# Altium schematic sheet main.SchDoc
size A4; SheetNumber: 2; SheetTotal: 6; SPICEModelCacheQOCYWOGJ: <root> / <DocumentId>QOCYWOGJ</DocumentId> / </root>
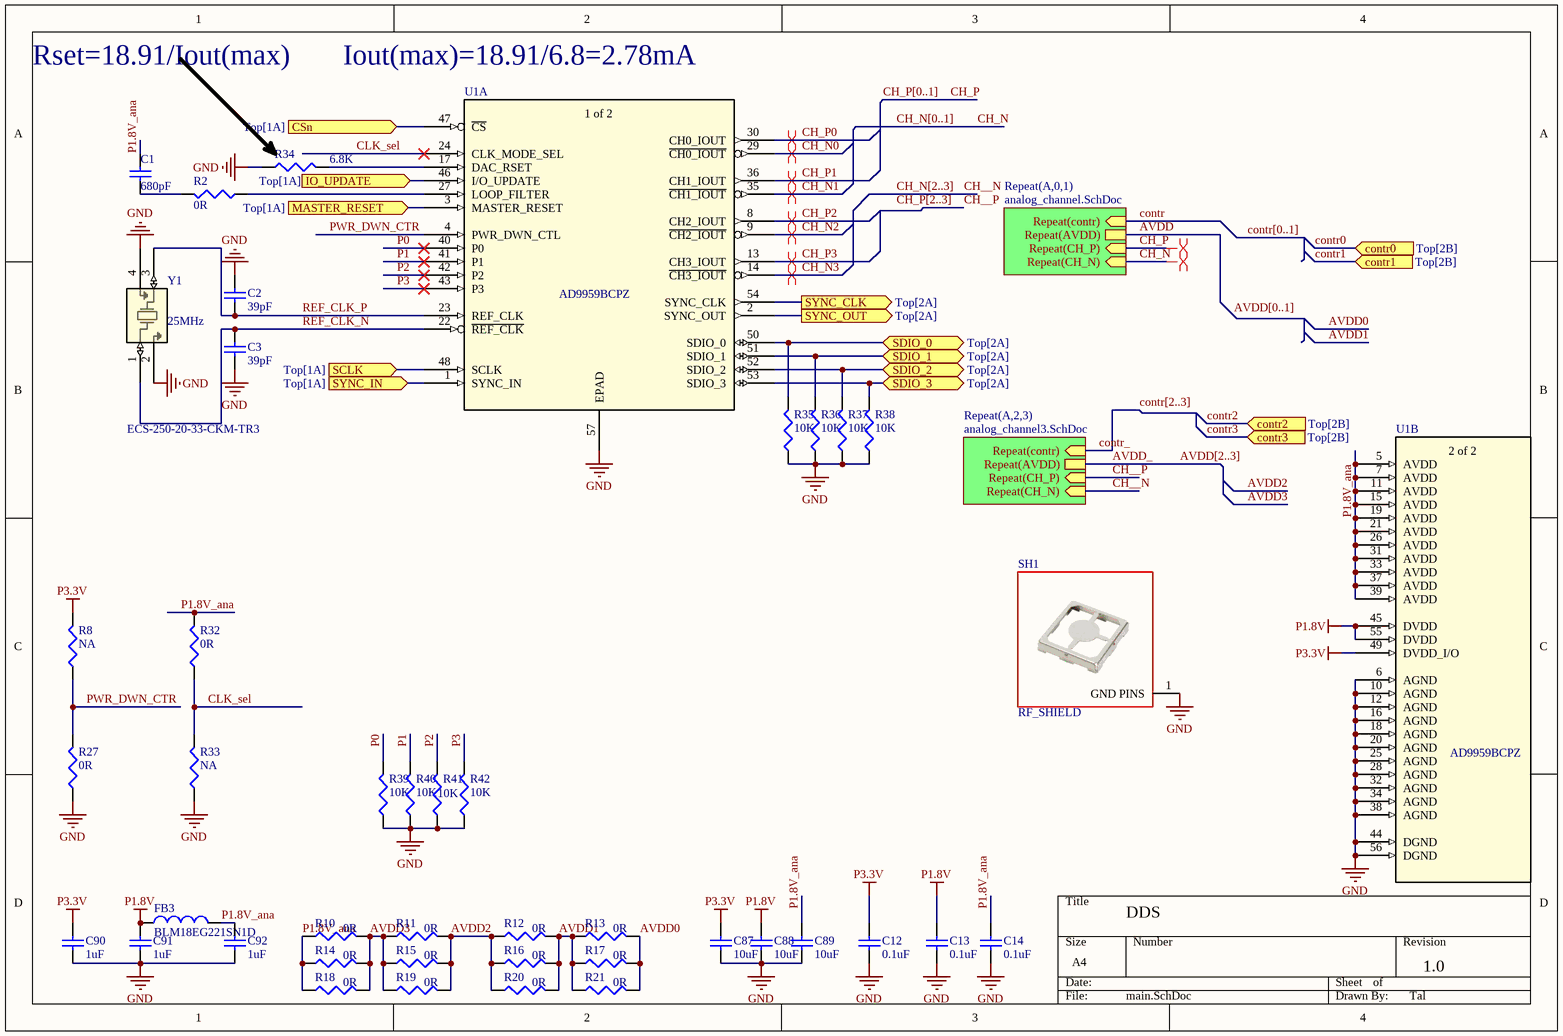
[diagram p0: main.SchDoc]

## Parts
C1  Capacitance: 680pF  [C0402]  (hidden comment: 680pF 50V)
C2  Capacitance: 39pF  [C0402]  (hidden comment: 39pF 50V)
C3  Capacitance: 39pF  [C0402]  (hidden comment: 39pF 50V)
C12  Capacitance: 0.1uF  [C0402]  (hidden comment: 0.1uF 50V)
C13  Capacitance: 0.1uF  [C0402]  (hidden comment: 0.1uF 50V)
C14  Capacitance: 0.1uF  [C0402]  (hidden comment: 0.1uF 50V)
C87  Capacitance: 10uF  [C0402]  (hidden comment: 10uF 10V)
C88  Capacitance: 10uF  [C0402]  (hidden comment: 10uF 10V)
C89  Capacitance: 10uF  [C0402]  (hidden comment: 10uF 10V)
C90  Capacitance: 1uF  [C0402]  (hidden comment: 1uF 25V)
C91  Capacitance: 1uF  [C0402]  (hidden comment: 1uF 25V)
C92  Capacitance: 1uF  [C0402]  (hidden comment: 1uF 25V)
FB3  BLM18EG221SN1D  [fb0603]
R2  0R  [R0402]
R8  NA  [R0402]
R10  0R  [R0805]
R11  0R  [R0805]
R12  0R  [R0805]
R13  0R  [R0805]
R14  0R  [R0805]
R15  0R  [R0805]
R16  0R  [R0805]
R17  0R  [R0805]
R18  0R  [R0805]
R19  0R  [R0805]
R20  0R  [R0805]
R21  0R  [R0805]
R27  0R  [R0402]
R32  0R  [R0402]
R33  NA  [R0402]
R34  6.8K  [R0402]
R35  10K  [R0402]
R36  10K  [R0402]
R37  10K  [R0402]
R38  10K  [R0402]
R39  10K  [R0402]
R40  10K  [R0402]
R41  10K  [R0402]
R42  10K  [R0402]
SH1  RF_SHIELD  [SMS201F]
U1  AD9959BCPZ  [CP_56_1_ADI]  (parts A,B of 2)
Y1  ECS-250-20-33-CKM-TR3  [SMD4_ECX-32_3p2x2p5_ECS]

## Sub-sheets
Repeat(A,0,1) = analog_channel.SchDoc: Repeat(contr) (in), Repeat(AVDD), Repeat(CH_P) (in), Repeat(CH_N) (in)
Repeat(A,2,3) = analog_channel3.SchDoc: Repeat(contr) (in), Repeat(AVDD), Repeat(CH_P) (in), Repeat(CH_N) (in)

## Ports
contr0 (in, see Top[2B]), contr1 (in, see Top[2B]), contr2 (in, see Top[2B]), contr3 (in, see Top[2B]), CSn (in, see Top[1A]), IO_UPDATE (in, see Top[1A]), MASTER_RESET (in, see Top[1A]), SCLK (in, see Top[1A]), SDIO_0 (bidir, see Top[2A]), SDIO_1 (bidir, see Top[2A]), SDIO_2 (bidir, see Top[2A]), SDIO_3 (bidir, see Top[2A]), SYNC_CLK (out, see Top[2A]), SYNC_IN (in, see Top[1A]), SYNC_OUT (out, see Top[2A])

## Nets
GND: C2.2 C3.1 C12.1 C13.1 C14.1 C87.1 C88.1 C89.1 C90.1 C91.1 C92.1 R27.1 R33.1 R34.1 R35.1 R36.1 R37.1 R38.1 R39.1 R40.1 R41.1 R42.1 SH1.1(GND_PINS) U1.6(AGND) U1.10(AGND) U1.12(AGND) U1.16(AGND) U1.18(AGND) U1.20(AGND) U1.25(AGND) U1.28(AGND) U1.32(AGND) U1.34(AGND) U1.38(AGND) U1.44(DGND) U1.56(DGND) U1.57(EPAD) Y1.2 Y1.4
P1.8V: C13.2 C88.2 C91.2 FB3.1 U1.45(DVDD) U1.55(DVDD)
P3.3V: C12.2 C87.2 C90.2 R8.2 U1.49(DVDD_I/O)
AVDD: sheet Repeat(A,0,1)/Repeat(AVDD)
AVDD0: R13.2 R17.2 R21.2
AVDD1: R12.2 R13.1 R16.2 R17.1 R20.2 R21.1
AVDD2: R11.2 R12.1 R15.2 R16.1 R19.2 R20.1
AVDD3: R10.2 R11.1 R14.2 R15.1 R18.2 R19.1
AVDD[2..3]: sheet Repeat(A,2,3)/Repeat(AVDD)  [also labelled AVDD_]
CH__N: sheet Repeat(A,2,3)/Repeat(CH_N)
CH__P: sheet Repeat(A,2,3)/Repeat(CH_P)
CH_N: sheet Repeat(A,0,1)/Repeat(CH_N)
CH_N0: U1.29(~{CH0_IOUT})
CH_N1: U1.35(~{CH1_IOUT})
CH_N2: U1.9(~{CH2_IOUT})
CH_N3: U1.14(~{CH3_IOUT})
CH_P: sheet Repeat(A,0,1)/Repeat(CH_P)
CH_P0: U1.30(CH0_IOUT)
CH_P1: U1.36(CH1_IOUT)
CH_P2: U1.8(CH2_IOUT)
CH_P3: U1.13(CH3_IOUT)
CLK_sel: R32.1 R33.2 U1.24(CLK_MODE_SEL)
contr: sheet Repeat(A,0,1)/Repeat(contr)
contr0: port contr0
contr1: port contr1
contr2: port contr2
contr3: port contr3
contr[2..3]: sheet Repeat(A,2,3)/Repeat(contr)  [also labelled contr_]
CSn: U1.47(~{CS}) ; port CSn
IO_UPDATE: U1.46(I/O_UPDATE) ; port IO_UPDATE
MASTER_RESET: U1.3(MASTER_RESET) ; port MASTER_RESET
P0: R39.2 U1.40(P0)
P1: R40.2 U1.41(P1)
P1.8V_ana: C1.1 C14.2 C89.2 C92.2 FB3.2 R10.1 R14.1 R18.1 R32.2 U1.5(AVDD) U1.7(AVDD) U1.11(AVDD) U1.15(AVDD) U1.19(AVDD) U1.21(AVDD) U1.26(AVDD) U1.31(AVDD) U1.33(AVDD) U1.37(AVDD) U1.39(AVDD)
P2: R41.2 U1.42(P2)
P3: R42.2 U1.43(P3)
PWR_DWN_CTR: R8.1 R27.2 U1.4(PWR_DWN_CTL)
REF_CLK_N: C3.2 U1.22(~{REF_CLK}) Y1.1
REF_CLK_P: C2.1 U1.23(REF_CLK) Y1.3
SCLK: U1.48(SCLK) ; port SCLK
SDIO_0: R35.2 U1.50(SDIO_0) ; port SDIO_0
SDIO_1: R36.2 U1.51(SDIO_1) ; port SDIO_1
SDIO_2: R37.2 U1.52(SDIO_2) ; port SDIO_2
SDIO_3: R38.2 U1.53(SDIO_3) ; port SDIO_3
SYNC_CLK: U1.54(SYNC_CLK) ; port SYNC_CLK
SYNC_IN: U1.1(SYNC_IN) ; port SYNC_IN
SYNC_OUT: U1.2(SYNC_OUT) ; port SYNC_OUT
NetC1_2: C1.2 R2.2
NetR2_1: R2.1 U1.27(LOOP_FILTER)
NetR34_2: R34.2 U1.17(DAC_RSET)

## Buses and harness runs
bus AVDD[0..1]
bus CH_N[0..1]
bus CH_N[2..3]
bus CH_P[0..1]
bus CH_P[2..3]
bus contr[0..1]

## Layout directives
differential pair: CH_N, CH_N0, CH_N1, CH_N2, CH_N3, CH_P, CH_P0, CH_P1, CH_P2, CH_P3

## Notes on the sheet
- Rset=18.91/Iout(max)
- Iout(max)=18.91/6.8=2.78mA
- (near Y1) 25MHz
- DDS
- 1.0
- Tal
- Labels drawn without touching a wire or pin: CH_P[2..3]
- (in symbol AD9959BCPZ, part A) 1 of 2
- (in symbol AD9959BCPZ, part B) 2 of 2

## Library data of the parts
C1 = CAP CER 6.8pF 50V NP0 0402: CAP CER 680PF 50V NP0 0402; Manufacturer Part Number: C1005C0G1H6R8D; Manufacturer: TDK Corporation; LANDA P/N: ECP-000033; RoHS: RoHS Compliant; Package / Case: 0402 (1005 Metric); ComponentLink1URL: http://www.tdk.com/pdf/general_B11.pdf; ComponentLink1Description: http://www.tdk.com/pdf/general_B11.pdf; Voltage - Rated: 50V
C2 C3 = CAP CER 6.8pF 50V NP0 0402: CAP CER 39PF 50V NP0 0402; Manufacturer Part Number: C1005C0G1H6R8D; Manufacturer: TDK Corporation; LANDA P/N: ECP-000033; RoHS: RoHS Compliant; Package / Case: 0402 (1005 Metric); ComponentLink1URL: http://www.tdk.com/pdf/general_B11.pdf; ComponentLink1Description: http://www.tdk.com/pdf/general_B11.pdf; Voltage - Rated: 50V
C12-C14 = CAP CER 6.8pF 50V NP0 0402: CAP CER 0.1uF 50V NP0 0402; Manufacturer Part Number: C1005C0G1H6R8D; Manufacturer: TDK Corporation; LANDA P/N: ECP-000033; RoHS: RoHS Compliant; Package / Case: 0402 (1005 Metric); ComponentLink1URL: http://www.tdk.com/pdf/general_B11.pdf; ComponentLink1Description: http://www.tdk.com/pdf/general_B11.pdf; Voltage - Rated: 50V
C87-C89 = CAP CER 6.8pF 50V NP0 0402: CAP CER 10uF 10V X5R 0402; Manufacturer Part Number: C1005C0G1H6R8D; Manufacturer: TDK Corporation; LANDA P/N: ECP-000033; Voltage - Rated: 50V; RoHS: RoHS Compliant; Package / Case: 0402 (1005 Metric); ComponentLink1URL: http://www.tdk.com/pdf/general_B11.pdf; ComponentLink1Description: http://www.tdk.com/pdf/general_B11.pdf
C90-C92 = CAP CER 6.8pF 50V NP0 0402: CAP CER 1uF 25V X5R 0402; Manufacturer Part Number: C1005C0G1H6R8D; Manufacturer: TDK Corporation; LANDA P/N: ECP-000033; Voltage - Rated: 50V; RoHS: RoHS Compliant; Package / Case: 0402 (1005 Metric); ComponentLink1URL: http://www.tdk.com/pdf/general_B11.pdf; ComponentLink1Description: http://www.tdk.com/pdf/general_B11.pdf
FB3 = BK1608HS600-T: FERRITE BEAD 220_OHM@100MHz 0603 2A 50mohm_DC; Manufacturer: Taiyo Yuden; LANDA P/N: EIN-000010; RoHS: RoHS Compliant; Package / Case: 0603 (1608 Metric); ComponentLink1URL: http://www.yuden.co.jp/ut/product/category/emisuppression/BK1608HS600-T.pdf; ComponentLink1Description: http://www.yuden.co.jp/ut/product/category/emisuppression/BK1608HS600-T.pdf; Manufacturer Part Number: BLM18EG221SN1D
R2 R8 R27 R32 R33 = RES 100 OHM 1/10W 1% 0402 SMD: RES 0 OHM 1/10W 1% 0402 SMD; Manufacturer Part Number: ERJ-2RKF1000X; Manufacturer: Panasonic Electronic Components; LANDA P/N: ERS-000079; Assembly: N.C; Package / Case: 0402 (1005 Metric); RoHS: RoHS Compliant; ComponentLink1URL: http://industrial.panasonic.com/www-cgi/jvcr13pz.cgi?E+PZ+3+AOA0002+ERJ2RKF1000X+7+WW; ComponentLink1Description: http://industrial.panasonic.com/www-cgi/jvcr13pz.cgi?E+PZ+3+AOA0002+ERJ2RKF1000X+7+WW; Supplier Device Package: 0402
R10-R21 = RES 200 OHM 1/8W 1% 0805 SMD: RES 0 OHM 1/8W 1% 0805 SMD; Manufacturer Part Number: RMCF0805FT200R; Manufacturer: Stackpole Electronics Inc; Power (Watts): 0.125W, 1/8W; LANDA P/N: ERS-000050; Package / Case: 0805 (2012 Metric); RoHS: RoHS Compliant; Supplier Device Package: 0805; ComponentLink1URL: http://www.seielect.com/Catalog/SEI-RMCF_RMCP.pdf; ComponentLink1Description: http://www.seielect.com/Catalog/SEI-RMCF_RMCP.pdf
R34 = RES 3.09K OHM 1/16W 1% 0402: RES 6.8K OHM 1/16W 1% 0402; Manufacturer Part Number: RMCF0402FT3K09; Manufacturer: Stackpole Electronics Inc; Power (Watts): 0.063W, 1/16W; LANDA P/N: ERS-000063; Supplier Device Package: 0402; Package / Case: 0402 (1005 Metric); RoHS: RoHS Compliant; ComponentLink1URL: http://www.seielect.com/Catalog/SEI-RMCF_RMCP.pdf; ComponentLink1Description: http://www.seielect.com/Catalog/SEI-RMCF_RMCP.pdf
R35-R42 = RES 3.09K OHM 1/16W 1% 0402: RES 10K OHM 1/16W 1% 0402; Manufacturer Part Number: RMCF0402FT3K09; Manufacturer: Stackpole Electronics Inc; Power (Watts): 0.063W, 1/16W; LANDA P/N: ERS-000063; Supplier Device Package: 0402; Package / Case: 0402 (1005 Metric); RoHS: RoHS Compliant; ComponentLink1URL: http://www.seielect.com/Catalog/SEI-RMCF_RMCP.pdf; ComponentLink1Description: http://www.seielect.com/Catalog/SEI-RMCF_RMCP.pdf
SH1 = RF_SHIELD: RF SHIELD 0.5" X 0.538" SMD; Manufacturer_Part_Number: SMS-201F; Manufacturer: Leader Tech Inc.; ComponentLink1Description: Datasheet; ComponentLink1URL: https://www.leadertechinc.com/assets/files/EngineeringDrawings/SMS-201.pdf
U1 = AD9959BCPZ: No Description Available; Mfr_Name: Analog Devices Inc; Copyright: Copyright (C) 2023 Ultra Librarian. All rights reserved.; Manufacturer_Part_Number: AD9959BCPZ; RefDes: RefDes; Type: DEV
Y1 = ECS-250-20-33-CKM-TR3: No Description Available; Mfr_Name: ECS International; Type: DEV; Copyright: Copyright (C) 2023 Ultra Librarian. All rights reserved.; Manufacturer_Part_Number: ECS-250-20-33-CKM-TR3; RefDes: RefDes